# Altium project EMBDED_REMOTE.PrjPcb
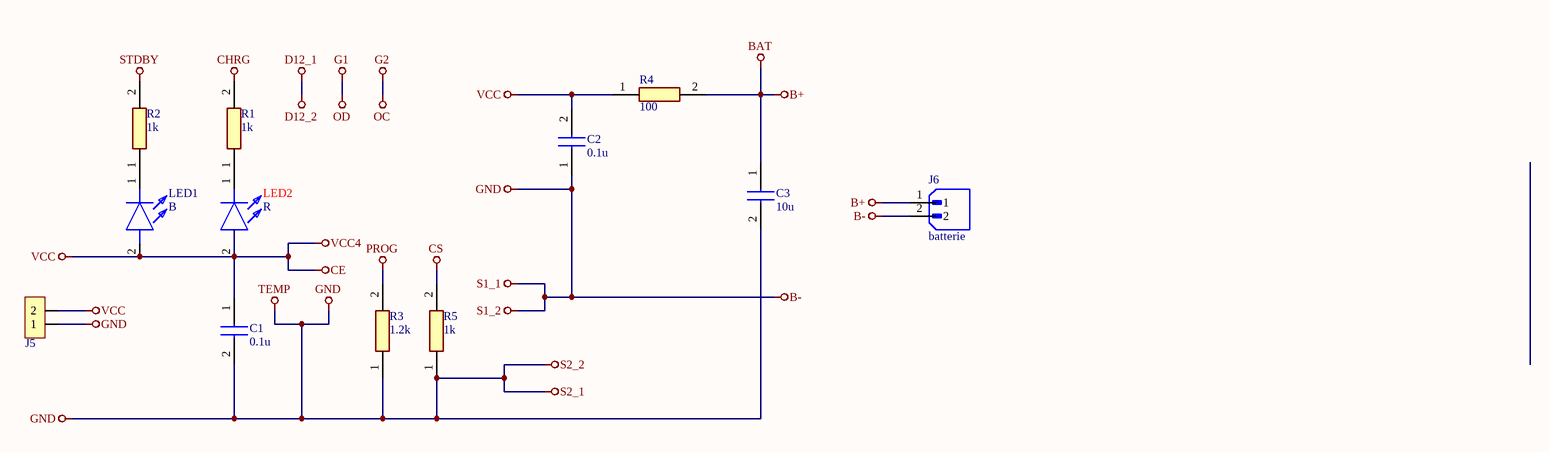
[diagram p0: LithiumChargerShematics.SchDoc]
4 sheets, 38 parts. Net scope: global (net labels, ports and power ports of the same name join across sheets).
Board file: Remote.PcbDoc
Sheets:
  LithiumChargerShematics.SchDoc
  RemoteShematics.SchDoc
  programmeShematics.SchDoc
  LM317Shamtics.SchDoc

## Sheet LithiumChargerShematics.SchDoc
size A4

### Parts
C1  0.1u  [CAPC2012X94N]
C2  0.1u  [CAPC2013X140N]
C3  10u  [CAPC2013X140N]
J5  Header Pins  [HEADER PIN 1x2]  (value not drawn)
J6  batterie  [JST_B2B-XH-A(LF)(SN)]
LED1  B  [LEDM2012X80N]
LED2  R  [LEDM2012X80N]
R1  1k  [RESC2012X65N]
R2  1k  [RESC2012X65N]
R3  1.2k  [RESC2012X65N]
R4  100  [RESC2012X65N]
R5  1k  [RESC2012X65N]

### Nets
B+: C3.1(C1) J6.1 R4.2  [also labelled BAT]
B-: C1.2 C2.1(C1) C3.2(C2) J5.1 J6.2 R3.1 R5.1  [also labelled GND, S1_1, S1_2, S2_1, S2_2, TEMP]
CE: C1.1 C2.2(C2) J5.2 LED1.2(A) LED2.2(A) R4.1  [also labelled VCC, VCC4]  [project net +3V3]
CHRG: R1.2
CS: R5.2
PROG: R3.2
STDBY: R2.2
NetLED1_1: LED1.1(K) R2.1
NetLED2_1: LED2.1(K) R1.1

### Library data of the parts
C1 = 08055A331FAT2A: Capacitor; Manufacturer_Name: Kyocera AVX; Datasheet Link: https://componentsearchengine.com/Datasheets/1/06031A100FAT2A.pdf; Height: 0.94mm; Manufacturer_Part_Number: 08055A331FAT2A; Mouser Part Number: 581-08055A331FAT2A; Mouser Price/Stock: https://www.mouser.com/Search/Refine.aspx?Keyword=581-08055A331FAT2A; Arrow Part Number: 08055A331FAT2A; Arrow Price/Stock: https://www.arrow.com/en/products/08055a331fat2a/avx
C2 C3 = 08053C474JAT2A: Capacitor; Manufacturer_Name: Kyocera AVX; Manufacturer_Part_Number: 08053C474JAT2A; Mouser Part Number: 581-08053C474JAT2A; Mouser Price/Stock: https://www.mouser.co.uk/ProductDetail/KYOCERA-AVX/08053C474JAT2A?qs=bb%252B1MDm7h6L8wnHciIrwGg%3D%3D
J5 = Header Pins 1x2
J6 = B2B-XH-A(LF)(SN): Connector Header Through Hole 2 position 0.098 (2.50mm); MF: JST Sales America Inc.; SnapEDA_Link: https://www.snapeda.com/parts/B2B-XH-A(LF)(SN)/JST+Sales+America+Inc./view-part/?ref=snap; Package: None; Value: *; MP: B2B-XH-A(LF)(SN); Check_prices: https://www.snapeda.com/parts/B2B-XH-A(LF)(SN)/JST+Sales+America+Inc./view-part/?ref=eda
LED1 LED2 = 150080GS75000: LED; Manufacturer_Name: Wurth Elektronik; Datasheet Link: https://katalog.we-online.com/led/datasheet/150080GS75000.pdf; Height: 0.8mm; Manufacturer_Part_Number: 150080GS75000; Mouser Part Number: 710-150080GS75000; Mouser Price/Stock: https://www.mouser.co.uk/ProductDetail/Wurth-Elektronik/150080GS75000?qs=2kOmHSv6VfQRoTEZVk1mGA%3D%3D
R1 R3-R5 = CPF0805B102RE1: Resistor; Manufacturer_Name: TE Connectivity; Datasheet Link: http://docs-europe.electrocomponents.com/webdocs/13d1/0900766b813d116f.pdf; Height: 0.65mm; Manufacturer_Part_Number: CPF0805B102RE1
R2 = CPF0805B10K5E1: Resistor; Manufacturer_Name: TE Connectivity; Datasheet Link: http://docs-europe.electrocomponents.com/webdocs/13d1/0900766b813d116f.pdf; Height: 0.65mm; Manufacturer_Part_Number: CPF0805B10K5E1; Mouser Part Number: 279-CPF0805B10K5E1; Mouser Price/Stock: https://www.mouser.com/Search/Refine.aspx?Keyword=279-CPF0805B10K5E1

## Sheet RemoteShematics.SchDoc
size A4
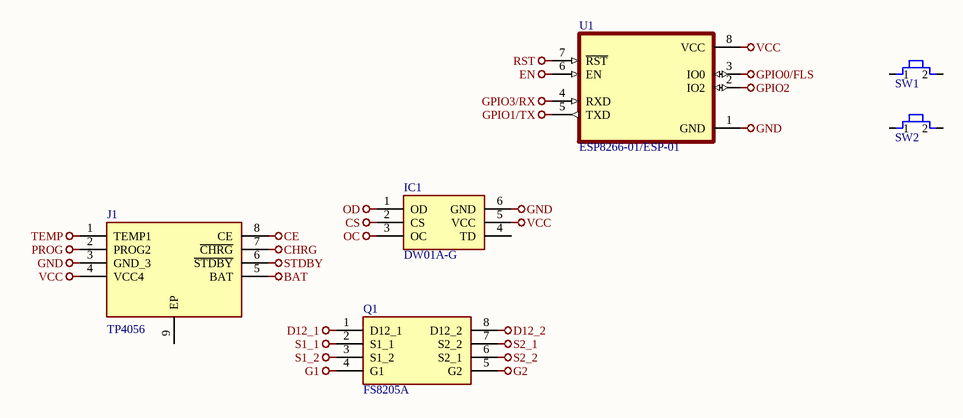
[diagram p1: RemoteShematics.SchDoc]

### Parts
IC1  DW01A-G  [SOT95P190X145-6N]
J1  TP4056  [SOIC127P600X175-9N]
Q1  FS8205A  [SOP65P640X120-8N]
SW1  Switch button 6 x 3.5 x 2.5 mm  [Switch button  6 x 3.5 x 2.5 mm]  (value not drawn)
SW2  Switch button 6 x 3.5 x 2.5 mm  [Switch button  6 x 3.5 x 2.5 mm]  (value not drawn)
U1  ESP8266-01/ESP-01  [XCVR_ESP8266-01/ESP-01]

### Nets
BAT: J1.5(BAT)  [project net B+]
CE: IC1.5(VCC) J1.4(VCC4) J1.8(CE) U1.8(VCC)  [also labelled VCC]  [project net +3V3]
CHRG: J1.7(~{CHRG})
CS: IC1.2(CS)
D12_1: Q1.1(D12_1) Q1.8(D12_2)  [also labelled D12_2]
EN: U1.6(EN)
G1: IC1.1(OD) Q1.4(G1)  [also labelled OD]
G2: IC1.3(OC) Q1.5(G2)  [also labelled OC]
GND: IC1.6(GND) J1.1(TEMP1) J1.3(GND_3) Q1.2(S1_1) Q1.3(S1_2) Q1.6(S2_1) Q1.7(S2_2) U1.1(GND)  [also labelled S1_1, S1_2, S2_1, S2_2, TEMP]  [project net B-]
GPIO0/FLS: U1.3(IO0)
GPIO1/TX: U1.5(TXD)
GPIO2: U1.2(IO2)
GPIO3/RX: U1.4(RXD)
PROG: J1.2(PROG2)
RST: U1.7(~{RST})
STDBY: J1.6(~{STDBY})

Not connected (* = marked no-connect by the designer): IC1 4(TD); J1 9(EP); SW1 1 2; SW2 1 2

### Library data of the parts
IC1 = DW01A-G: Integrated Circuit; Manufacturer_Name: SII Semiconductor; Datasheet Link: http://www.ic-fortune.com/upload/Download/DW01x-DS-17_EN.pdf; Height: 1.45mm; Manufacturer_Part_Number: DW01A-G
J1 = TP4056: Connector; Manufacturer_Name: NanJing Top Power; Datasheet Link: https://dlnmh9ip6v2uc.cloudfront.net/datasheets/Prototyping/TP4056.pdf; Height: 1.75mm; Manufacturer_Part_Number: TP4056
Q1 = FS8205A: Transistor; Manufacturer_Name: SII Semiconductor; Datasheet Link: http://www.ic-fortune.com/upload/Download/FS8205A-DS-12_EN.pdf; Height: 1.2mm; Manufacturer_Part_Number: FS8205A
SW1 SW2 = Switch button  6 x 3.5 x 2.5 mm
U1 = ESP8266-01/ESP-01: MakerFocus 4pcs ESP8266 ESP-01 Serial Wireless WiFi Transceiver Receiver Module 1MB SPI Flash DC3.0-3.6V Internet of Things WiFi Module Board Compatible with Ar duino; Value: *; MP: ESP8266-01/ESP-01; Package: None; Availability: Unavailable; Price: None

## Sheet programmeShematics.SchDoc
size A4
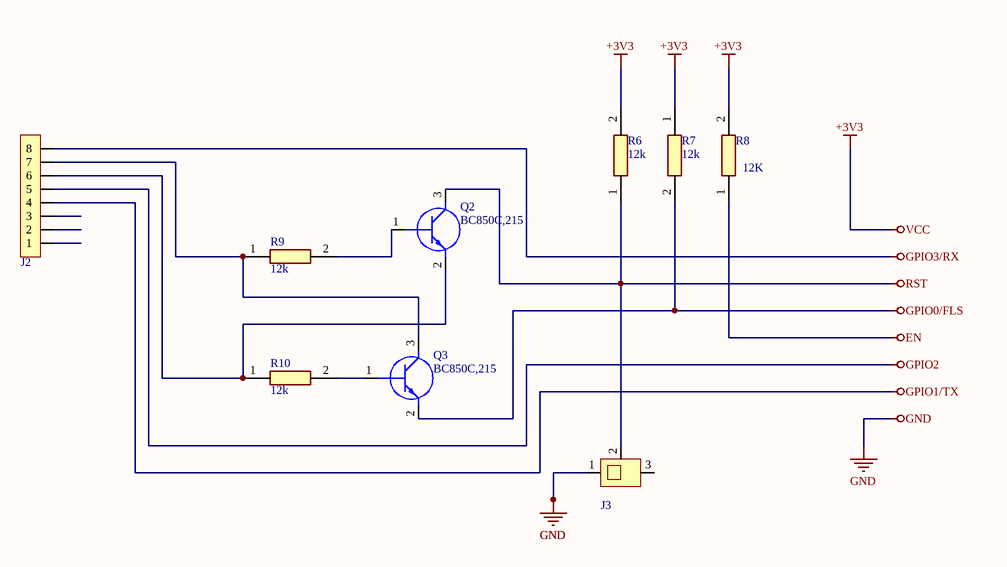
[diagram p2: programmeShematics.SchDoc]

### Parts
J2  Header Pins  [HEADER PIN 1x8]  (value not drawn)
J3  /ss-12d02-vg4  [Switch button]  (value not drawn)
Q2  BC850C,215  [SOT23]
Q3  BC850C,215  [SOT23]
R6  12k  [RESC2012X65N]
R7  12k  [RESC2012X65N]
R8  12K  [RESC2012X65N]
R9  12k  [RESC2012X65N]
R10  12k  [RESC2012X65N]

### Nets
+3V3: R6.2 R7.1 R8.2  [also labelled VCC]
EN: R8.1
GND: J3.1  [project net B-]
GPIO0/FLS: Q3.2(E) R7.2
GPIO1/TX: J2.4
GPIO2: J2.5
GPIO3/RX: J2.8
RST: J3.2 Q2.3(C) R6.1
NetJ2_6: J2.6 Q2.2(E) R10.1
NetJ2_7: J2.7 Q3.3(C) R9.1
NetQ2_1: Q2.1(B) R9.2
NetQ3_1: Q3.1(B) R10.2

Not connected (* = marked no-connect by the designer): J2 1 2 3; J3 3

### Library data of the parts
J2 = Header Pins 1x8
J3 = Switch slide button
Q2 Q3 = BC850C,215: Transistor BJT NPN; Manufacturer_Name: Nexperia; Datasheet Link: https://assets.nexperia.com/documents/data-sheet/BC849_BC850.pdf; Height: 1.1mm; Manufacturer_Part_Number: BC850C,215; Mouser Part Number: 771-BC850C-T/R; Mouser Price/Stock: https://www.mouser.co.uk/ProductDetail/Nexperia/BC850C215?qs=me8TqzrmIYVR%2FGACbHj0Ow%3D%3D; Arrow Part Number: BC850C,215; Arrow Price/Stock: https://www.arrow.com/en/products/bc850c215/nexperia?region=europe
R6-R10 = CPF0805B102RE1: as R1 on sheet LithiumChargerShematics; Datasheet Link: http://docs-europe.electrocomponents.com/webdocs/13d1/0900766b813d116f.pdf; Height: 0.65mm; Manufacturer_Part_Number: CPF0805B102RE1

## Sheet LM317Shamtics.SchDoc
size A4
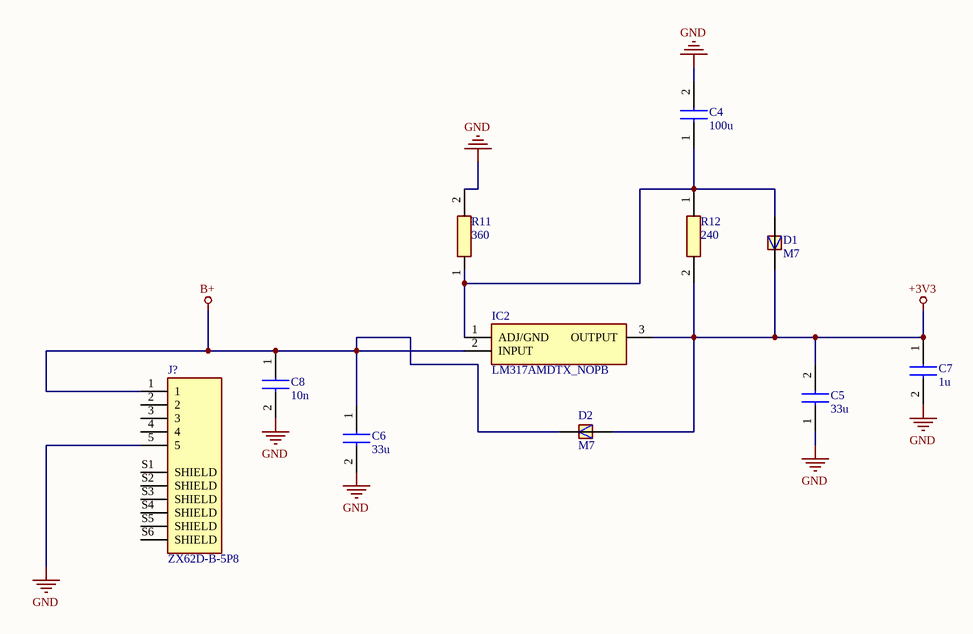
[diagram p3: LM317Shamtics.SchDoc]

### Parts
C4  100u  [CAPC2013X140N]
C5  33u  [CAPC2013X140N]
C6  33u  [CAPC2013X140N]
C7  1u  [CAPC2013X140N]
C8  10n  [CAPC2013X140N]
D1  M7  [DIOM505270X240]
D2  M7  [DIOM505270X240]
IC2  LM317AMDTX_NOPB  [LM78M05CDT]
J?  ZX62D-B-5P8  [HRS_ZX62D-B-5P8]
R11  360  [RESC2012X65N]
R12  240  [RESC2012X65N]

### Nets
+3V3: C5.2(C2) C7.1(C1) D1.C D2.A IC2.3(OUTPUT) R12.2
B+: C6.1(C1) C8.1(C1) D2.C IC2.2(INPUT) J?.1
GND: C4.2(C2) C5.1(C1) C6.2(C2) C7.2(C2) C8.2(C2) J?.5 R11.2  [project net B-]
NetC4_1: C4.1(C1) D1.A IC2.1(ADJ/GND) R11.1 R12.1

Not connected (* = marked no-connect by the designer): J? 2 3 4 S1(SHIELD) S2(SHIELD) S3(SHIELD) S4(SHIELD) S5(SHIELD) S6(SHIELD)

### Library data of the parts
C4-C8 = 08053C474JAT2A: as C2 on sheet LithiumChargerShematics; Manufacturer_Part_Number: 08053C474JAT2A; Mouser Part Number: 581-08053C474JAT2A; Mouser Price/Stock: https://www.mouser.co.uk/ProductDetail/KYOCERA-AVX/08053C474JAT2A?qs=bb%252B1MDm7h6L8wnHciIrwGg%3D%3D
D1 D2 = M7: Diode, SMA, 1000V, 1A, 150°C; MF: Diotec Semiconductor; SnapEDA_Link: https://www.snapeda.com/parts/M7/Diotec/view-part/?ref=snap; Package: DO-214AC Diotec; Value: *; MP: M7; Check_prices: https://www.snapeda.com/parts/M7/Diotec/view-part/?ref=eda
IC2 = LM317AMDTX_NOPB: Integrated Circuit; Manufacturer_Name: Texas Instruments; Manufacturer_Part_Number: LM317AMDTX/NOPB; Datasheet Link: http://www.ti.com/lit/gpn/lm317a; Mouser Part Number: 926-LM317AMDTX/NOPB; Mouser Price/Stock: https://www.mouser.co.uk/ProductDetail/Texas-Instruments/LM317AMDTX-NOPB?qs=X1J7HmVL2ZE2tJdeke3r6w%3D%3D; Arrow Part Number: LM317AMDTX/NOPB; Arrow Price/Stock: https://www.arrow.com/en/products/lm317amdtxnopb/texas-instruments?region=nac
J? = ZX62D-B-5P8: USB - micro B USB 2.0 Receptacle Connector 5 Position Surface Mount, Right Angle; Through Hole; MF: Hirose Connector; Package: None; Check_prices: https://www.snapeda.com/parts/ZX62D-B-5P8/Hirose/view-part/?ref=eda; Price: None; Purchase-URL: https://pricing.snapeda.com/search/part/ZX62D-B-5P8/?ref=eda; MP: ZX62D-B-5P8; Value: *; SnapEDA_Link: https://www.snapeda.com/parts/ZX62D-B-5P8/Hirose/view-part/?ref=snap; Availability: In Stock
R11 R12 = CPF0805B102RE1: as R1 on sheet LithiumChargerShematics; Datasheet Link: http://docs-europe.electrocomponents.com/webdocs/13d1/0900766b813d116f.pdf; Height: 0.65mm; Manufacturer_Part_Number: CPF0805B102RE1

## Nets that join several sheets
+3V3: LithiumChargerShematics (6 pins), RemoteShematics (IC1.5 J1.4 J1.8 U1.8), programmeShematics (R6.2 R7.1 R8.2), LM317Shamtics (6 pins)
B+: LithiumChargerShematics (C3.1 J6.1 R4.2), RemoteShematics (J1.5), LM317Shamtics (5 pins)
B-: LithiumChargerShematics (7 pins), RemoteShematics (8 pins), programmeShematics (J3.1), LM317Shamtics (7 pins)
CHRG: LithiumChargerShematics (R1.2), RemoteShematics (J1.7)
CS: LithiumChargerShematics (R5.2), RemoteShematics (IC1.2)
EN: RemoteShematics (U1.6), programmeShematics (R8.1)
GPIO0/FLS: RemoteShematics (U1.3), programmeShematics (Q3.2 R7.2)
GPIO1/TX: RemoteShematics (U1.5), programmeShematics (J2.4)
GPIO2: RemoteShematics (U1.2), programmeShematics (J2.5)
GPIO3/RX: RemoteShematics (U1.4), programmeShematics (J2.8)
PROG: LithiumChargerShematics (R3.2), RemoteShematics (J1.2)
RST: RemoteShematics (U1.7), programmeShematics (J3.2 Q2.3 R6.1)
STDBY: LithiumChargerShematics (R2.2), RemoteShematics (J1.6)